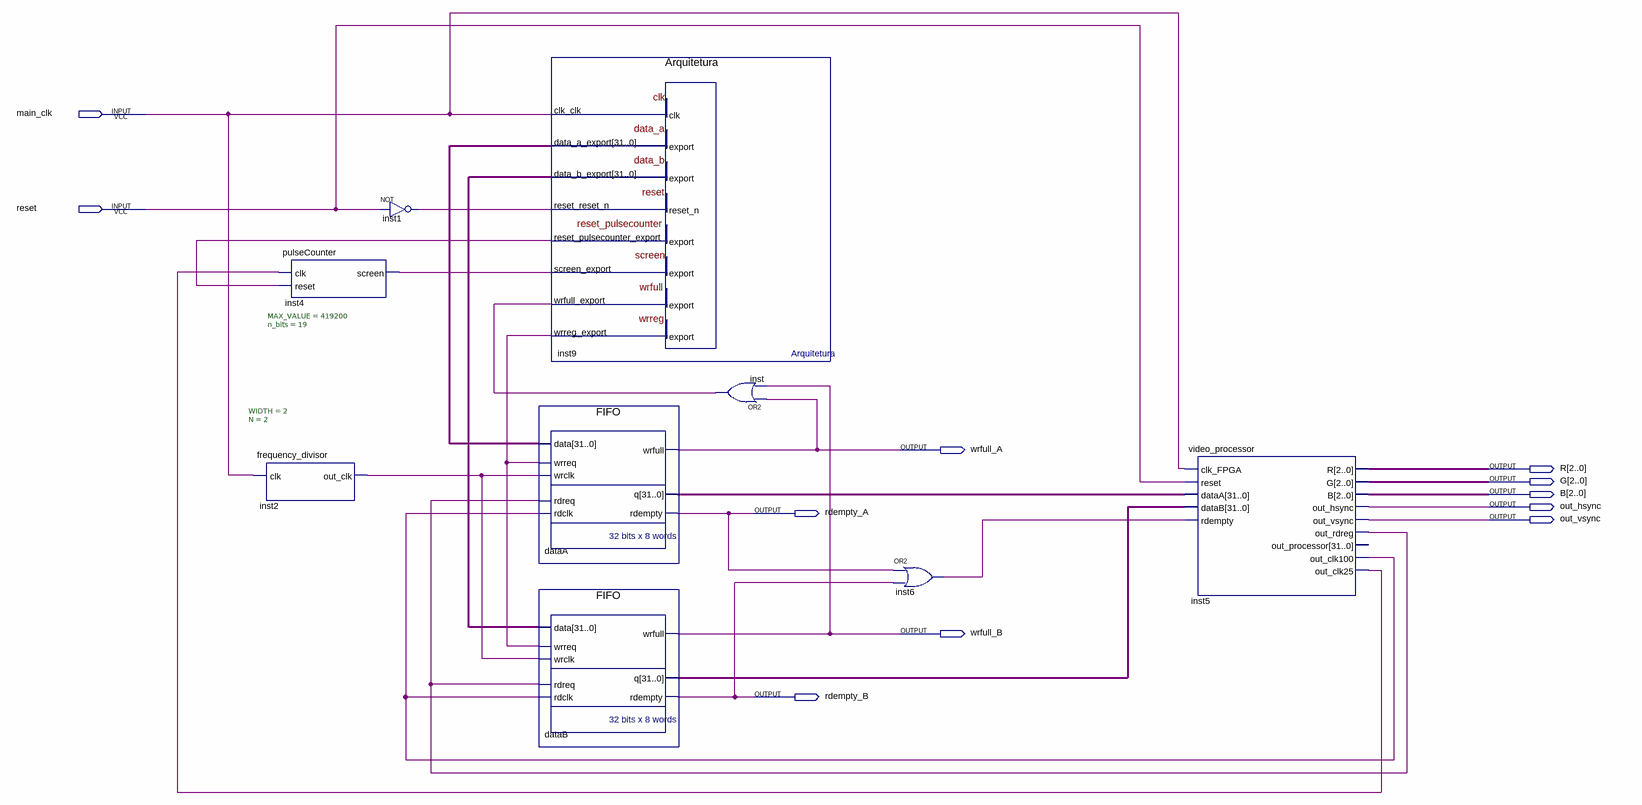
[diagram p0: schematic sheet]
// Quartus schematic ArquiteturaCollenda.bdf as structural Verilog: 9 symbols, 11 pins
module ArquiteturaCollenda (
  input  main_clk,
  input  reset,
  output wrfull_A,
  output [2:0] R,
  output [2:0] G,
  output [2:0] B,
  output out_hsync,
  output rdempty_A,
  output out_vsync,
  output wrfull_B,
  output rdempty_B
);

  wire inst1_out, inst2_out_clk, inst4_screen, inst5_out_clk25, inst5_out_clk100, inst5_out_rdreg, inst6_out,
       inst9_reset_pulsecounter_export, inst9_wrreg_export, inst_out;
  wire [31:0] dataA_q, dataB_q, inst9_data_a_export, inst9_data_b_export;

  pulseCounter #(.MAX_VALUE(419200), .n_bits(19)) inst4 (
    .clk(inst5_out_clk25), .reset(inst9_reset_pulsecounter_export), .screen(inst4_screen));
  frequency_divisor #(.WIDTH(2), .N(2)) inst2 (.clk(main_clk), .out_clk(inst2_out_clk));
  not inst1 (inst1_out, reset);
  FIFO dataA (
    .data(inst9_data_a_export), .wrreq(inst9_wrreg_export), .wrclk(inst2_out_clk), .rdreq(inst5_out_rdreg),
    .rdclk(inst5_out_clk100), .wrfull(wrfull_A), .q(dataA_q), .rdempty(rdempty_A));
  FIFO dataB (
    .data(inst9_data_b_export), .wrreq(inst9_wrreg_export), .wrclk(inst2_out_clk), .rdreq(inst5_out_rdreg),
    .rdclk(inst5_out_clk100), .wrfull(wrfull_B), .q(dataB_q), .rdempty(rdempty_B));
  Arquitetura inst9 (
    .clk_clk(main_clk), .reset_reset_n(inst1_out), .screen_export(inst4_screen), .wrfull_export(inst_out),
    .data_a_export(inst9_data_a_export), .data_b_export(inst9_data_b_export),
    .reset_pulsecounter_export(inst9_reset_pulsecounter_export), .wrreg_export(inst9_wrreg_export));
  or inst (inst_out, wrfull_A, wrfull_B);
  or inst6 (inst6_out, rdempty_A, rdempty_B);
  video_processor inst5 (
    .clk_FPGA(main_clk), .reset(reset), .dataA(dataA_q), .dataB(dataB_q), .rdempty(inst6_out), .R(R), .G(G),
    .B(B), .out_hsync(out_hsync), .out_vsync(out_vsync), .out_rdreg(inst5_out_rdreg),
    .out_clk100(inst5_out_clk100), .out_clk25(inst5_out_clk25));  // open: out_processor
endmodule
